# Altium project CMSIS_DAP.PrjPCB
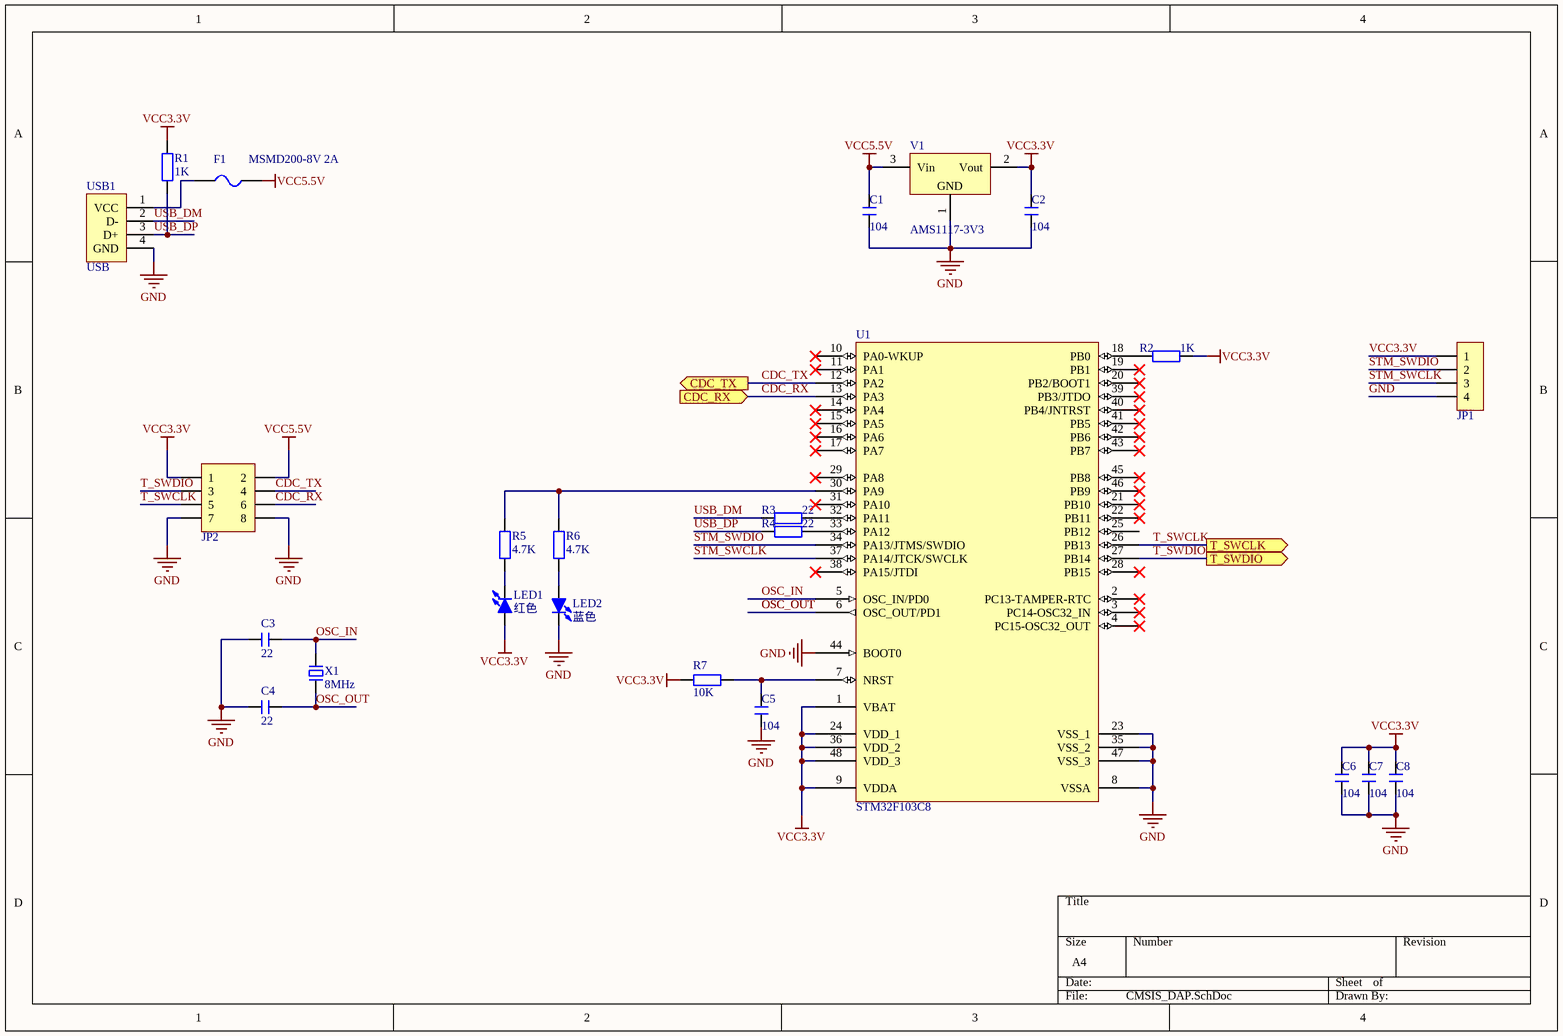
[diagram p0: CMSIS_DAP.SchDoc]
1 sheet, 24 parts. Net scope: flat (ports and power ports of the same name join across sheets).
Board file: CMSIS_DAP V2.0.PcbDoc

## Sheet CMSIS_DAP.SchDoc
size A4

### Parts
C1  104  [C 0805_L]
C2  104  [C 0805_L]
C3  22  [C 0402_L]
C4  22  [C 0402_L]
C5  104  [C 0603_L]
C6  104  [C 0603_L]
C7  104  [C 0603_L]
C8  104  [C 0603_L]
F1  MSMD200-8V 2A  [FU 0805]
JP1  HDR-1X4  [HDR2.54-LI-4P]  (value not drawn)
JP2  Header 4X2  [PCBComponent_1]  (value not drawn)
LED1  红色  [LED 0603R]
LED2  蓝色  [LED 0603R]
R1  1K  [R 0603_L]
R2  1K  [R 0603_L]
R3  22  [R 0603_L]
R4  22  [R 0603_L]
R5  4.7K  [R 0603_L]
R6  4.7K  [R 0603_L]
R7  10K  [R 0603_L]
U1  STM32F103C8  [LQFP48 7X7_M]
USB1  USB  [USB_A/P_A]
V1  AMS1117-3V3  [SOT89_L]
X1  8MHz  [OSC 5032-2P]

### Ports
CDC_RX (in), CDC_TX (out), T_SWCLK (out), T_SWDIO (out)

### Nets
GND: C1.2 C2.2 C3.1 C4.1 C5.2 C6.2 C7.2 C8.2 JP1.4 JP2.7 JP2.8 LED2.2(K) U1.8(VSSA) U1.23(VSS_1) U1.35(VSS_2) U1.44(BOOT0) U1.47(VSS_3) USB1.4(GND) V1.1(GND)
VCC3.3V: C2.1 C6.1 C7.1 C8.1 JP1.1 JP2.1 LED1.1(A) R1.1 R2.1 R7.2 U1.1(VBAT) U1.9(VDDA) U1.24(VDD_1) U1.36(VDD_2) U1.48(VDD_3) V1.2(Vout)
VCC5.5V: C1.1 F1.2 JP2.2 V1.3(Vin)
CDC_RX: JP2.6 U1.13(PA3) ; port CDC_RX
CDC_TX: JP2.4 U1.12(PA2) ; port CDC_TX
OSC_IN: C3.2 U1.5(OSC_IN/PD0) X1.2
OSC_OUT: C4.2 U1.6(OSC_OUT/PD1) X1.1
STM_SWCLK: JP1.3 U1.37(PA14/JTCK/SWCLK)
STM_SWDIO: JP1.2 U1.34(PA13/JTMS/SWDIO)
T_SWCLK: JP2.5 U1.26(PB13) ; port T_SWCLK
T_SWDIO: JP2.3 U1.27(PB14) ; port T_SWDIO
USB_DM: R3.2 USB1.2(D-)
USB_DP: R1.2 R4.2 USB1.3(D+)
NetC5_1: C5.1 R7.1 U1.7(NRST)
NetF1_1: F1.1 USB1.1(VCC)
NetLED1_2: LED1.2(K) R5.1
NetLED2_1: LED2.1(A) R6.1
NetR2_2: R2.2 U1.18(PB0)
NetR3_1: R3.1 U1.32(PA11)
NetR4_1: R4.1 U1.33(PA12)
NetR5_2: R5.2 R6.2 U1.30(PA9)

Not connected (* = marked no-connect by the designer): U1 2(PC13-TAMPER-RTC)* 3(PC14-OSC32_IN)* 4(PC15-OSC32_OUT)* 10(PA0-WKUP)* 11(PA1)* 14(PA4)* 15(PA5)* 16(PA6)* 17(PA7)* 19(PB1)* 20(PB2/BOOT1)* 21(PB10)* 22(PB11)* 25(PB12) 28(PB15)* 29(PA8)* 31(PA10)* 38(PA15/JTDI)* 39(PB3/JTDO)* 40(PB4/JNTRST)* 41(PB5)* 42(PB6)* 43(PB7)* 45(PB8)* 46(PB9)*

### Library data of the parts
C1-C8 = C: 无极性贴片电容; 版权归属: 源创客; BOM名称: 无极性贴片电容; 学习资源: www.ooocke.com
F1 = FU: 贴片保险丝; 版权归属: 源创客; BOM名称: 贴片保险丝; 学习资源: www.ooocke.com
JP1 = Header 4: 4P接插件; 版权归属: 源创客; BOM名称: 4P接插件; 学习资源: www.ooocke.com
JP2 = Header 4X2: 4*2P接插件; 版权归属: 源创客; BOM名称: 4*2P接插件; 学习资源: www.ooocke.com
LED1 LED2 = LED-SMD: 贴片LED; 版权归属: 源创客; BOM名称: 贴片LED; 学习资源: www.ooocke.com
R1-R7 = R: 贴片电阻; 版权归属: 源创客; BOM名称: 贴片电阻; 学习资源: www.ooocke.com
U1 = STM32F103C8: Flaah:64/RAM:20/IO:36; BOM名称: 32位STM单片机; 版权归属: 源创客; 学习资源: www.ooocke.com
USB1 = USB-A/P: USB-A型公接口; 版权归属: 源创客; BOM名称: USB-A型公接口; 学习资源: www.ooocke.com
V1 = AMS1117: 三端稳压芯片; BOM名称: 稳压芯片; 版权归属: 源创客; 学习资源: www.ooocke.com
X1 = XTAL-2P: 2脚无源脚晶振; 版权归属: 源创客; BOM名称: 2脚无源脚晶振; 学习资源: www.ooocke.com